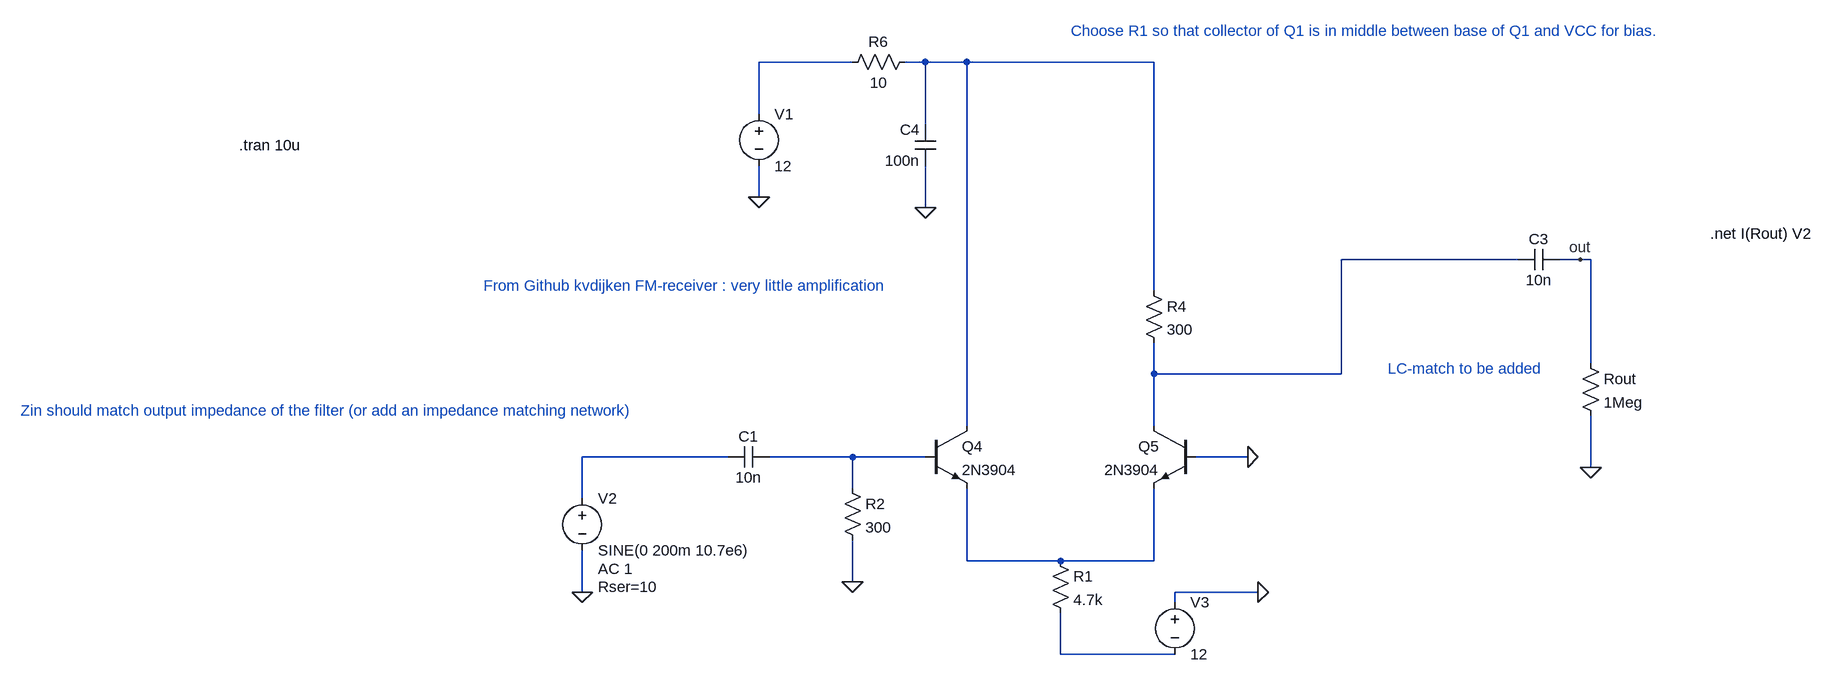
[diagram p0: schematic IF4.asc]
IF4.asc, the LTspice schematic file:
Version 4
SHEET 1 1960 1064
WIRE 464 -240 320 -240
WIRE 576 -240 544 -240
WIRE 640 -240 576 -240
WIRE 928 -240 640 -240
WIRE 320 -160 320 -240
WIRE 576 -144 576 -240
WIRE 320 -32 320 -80
WIRE 576 -16 576 -80
WIRE 1488 64 1216 64
WIRE 1584 64 1552 64
WIRE 1600 64 1584 64
WIRE 928 112 928 -240
WIRE 1600 224 1600 64
WIRE 928 240 928 192
WIRE 1216 240 1216 64
WIRE 1216 240 928 240
WIRE 640 320 640 -240
WIRE 928 320 928 240
WIRE 272 368 48 368
WIRE 464 368 336 368
WIRE 576 368 464 368
WIRE 1072 368 992 368
WIRE 1600 384 1600 304
WIRE 464 416 464 368
WIRE 48 432 48 368
WIRE 640 528 640 416
WIRE 784 528 640 528
WIRE 928 528 928 416
WIRE 928 528 784 528
WIRE 464 560 464 496
WIRE 48 576 48 512
WIRE 1088 576 960 576
WIRE 960 592 960 576
WIRE 784 672 784 608
WIRE 960 672 784 672
FLAG 320 -32 0
FLAG 48 576 0
FLAG 1600 384 0
FLAG 1584 64 out
FLAG 576 -16 0
FLAG 1088 576 0
FLAG 1072 368 0
FLAG 464 560 0
SYMBOL cap 336 352 R90
WINDOW 0 0 32 VBottom 2
WINDOW 3 32 32 VTop 2
SYMATTR InstName C1
SYMATTR Value 10n
SYMBOL voltage 320 -176 R0
WINDOW 123 0 0 Left 0
WINDOW 39 0 0 Left 0
SYMATTR InstName V1
SYMATTR Value 12
SYMBOL voltage 48 416 R0
WINDOW 123 24 124 Left 2
WINDOW 39 24 152 Left 2
SYMATTR Value2 AC 1
SYMATTR SpiceLine Rser=10
SYMATTR InstName V2
SYMATTR Value SINE(0 200m 10.7e6)
SYMBOL res 1584 208 R0
SYMATTR InstName Rout
SYMATTR Value 1Meg
SYMBOL cap 1552 48 R90
WINDOW 0 0 32 VBottom 2
WINDOW 3 32 32 VTop 2
SYMATTR InstName C3
SYMATTR Value 10n
SYMBOL res 560 -256 R90
WINDOW 0 0 56 VBottom 2
WINDOW 3 32 56 VTop 2
SYMATTR InstName R6
SYMATTR Value 10
SYMBOL cap 592 -80 R180
WINDOW 0 24 56 Left 2
WINDOW 3 24 8 Left 2
SYMATTR InstName C4
SYMATTR Value 100n
SYMBOL npn 576 320 R0
SYMATTR InstName Q4
SYMATTR Value 2N3904
SYMBOL npn 992 320 M0
SYMATTR InstName Q5
SYMATTR Value 2N3904
SYMBOL res 912 96 R0
SYMATTR InstName R4
SYMATTR Value 300
SYMBOL res 768 512 R0
SYMATTR InstName R1
SYMATTR Value 4.7k
SYMBOL voltage 960 576 R0
WINDOW 123 0 0 Left 0
WINDOW 39 0 0 Left 0
SYMATTR InstName V3
SYMATTR Value 12
SYMBOL res 448 400 R0
SYMATTR InstName R2
SYMATTR Value 300
TEXT 1784 24 Left 2 !.net I(Rout) V2
TEXT -480 -112 Left 2 !.tran 10u
TEXT -816 296 Left 2 ;Zin should match output impedance of the filter (or add an impedance matching network)
TEXT 800 -288 Left 2 ;Choose R1 so that collector of Q1 is in middle between base of Q1 and VCC for bias.
TEXT 1288 232 Left 2 ;LC-match to be added
TEXT -104 104 Left 2 ;From Github kvdijken FM-receiver : very little amplification

The netlist it stands for:
* IF4.asc
C1 N005 N004 10n
V1 N001 0 12
V2 N004 0 SINE(0 200m 10.7e6) AC 1 Rser=10
Rout out 0 1Meg
C3 out N003 10n
R6 N002 N001 10
C4 0 N002 100n
Q4 N002 N005 N006 0 2N3904
Q5 N003 0 N006 0 2N3904
R4 N002 N003 300
R1 N006 N007 4.7k
V3 0 N007 12
R2 N005 0 300
.model NPN NPN
.model PNP PNP
.lib standard.bjt
.net I(Rout) V2
.tran 10u
* Zin should match output impedance of the filter (or add an impedance matching network)
* Choose R1 so that collector of Q1 is in middle between base of Q1 and VCC for bias.
* LC-match to be added
* From Github kvdijken FM-receiver : very little amplification
.backanno
.end